# EAGLE design MPS_Drive_Amp_2 (EAGLE 9.5.2)
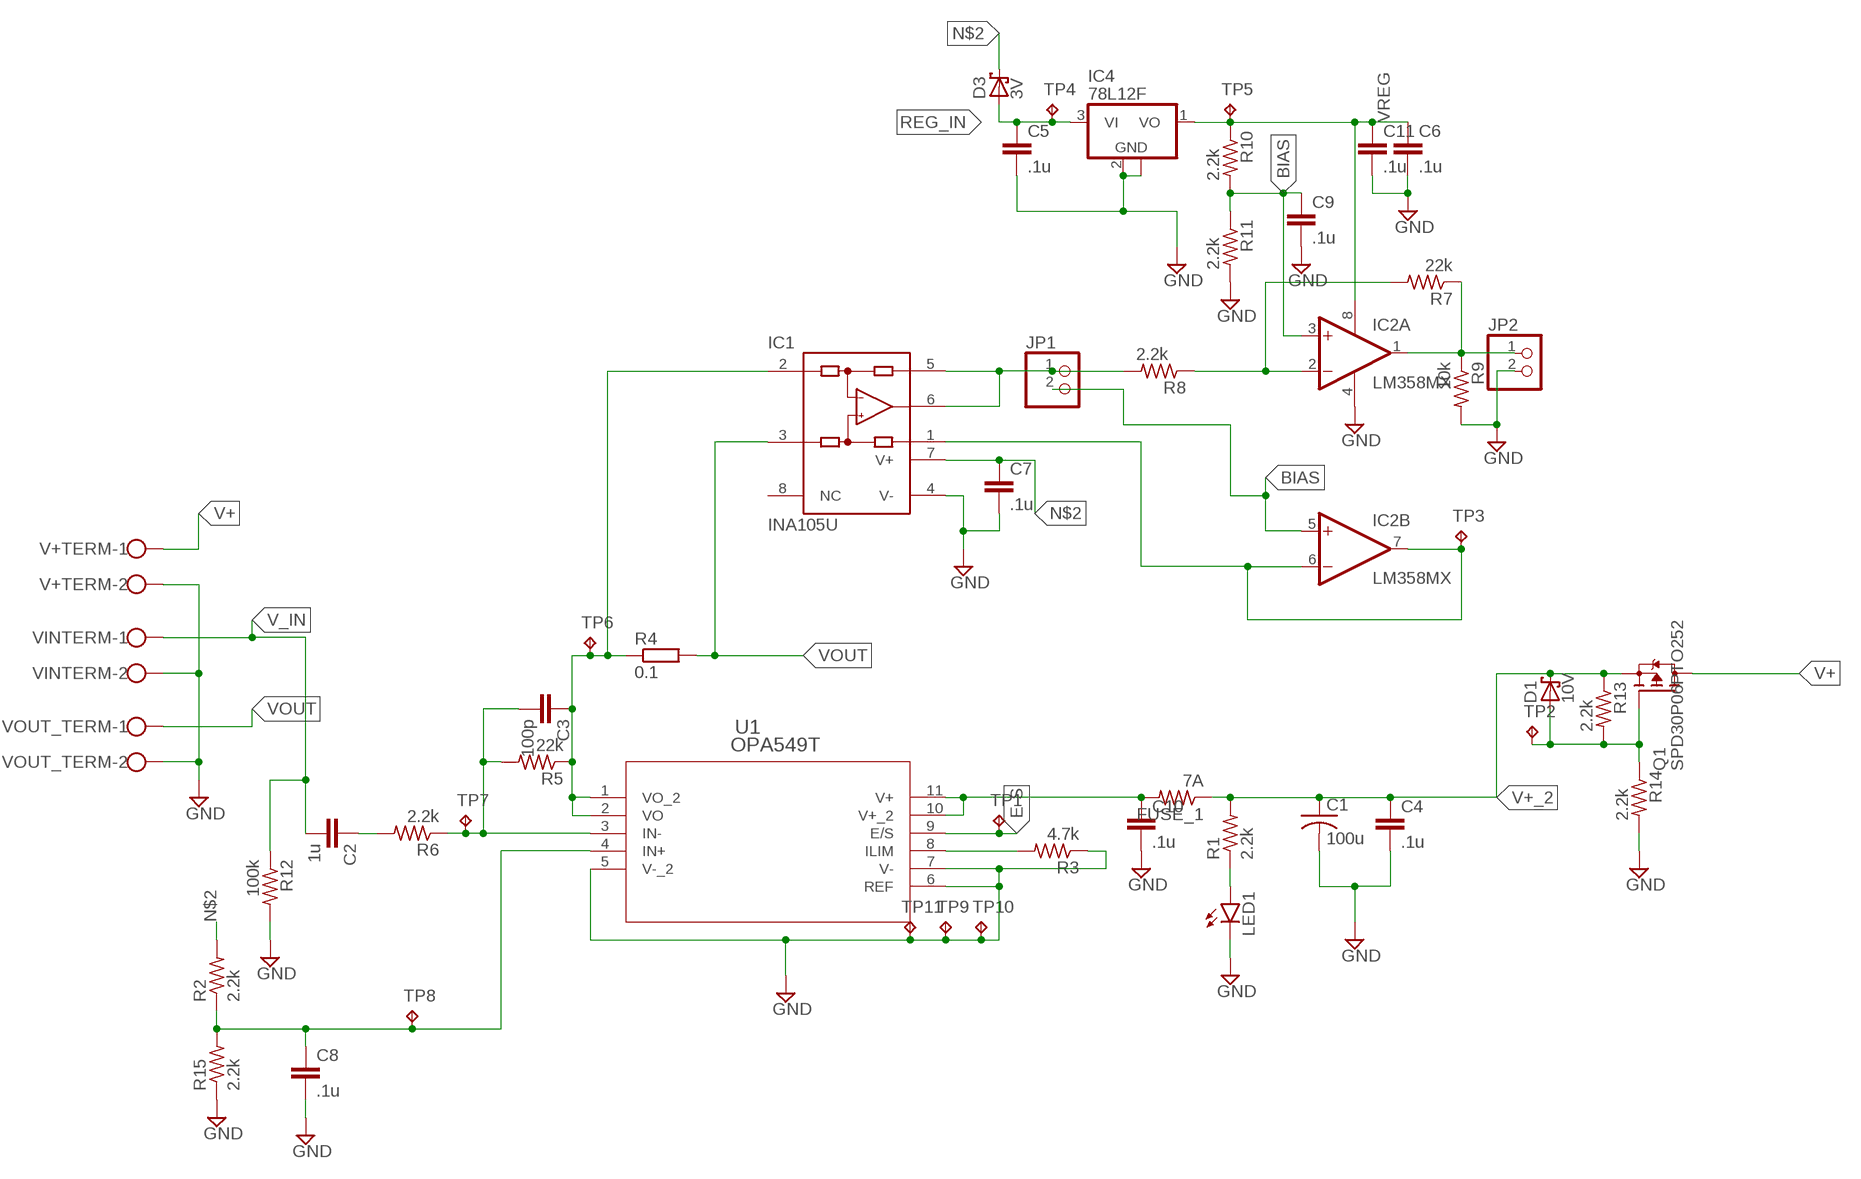
[diagram p0: schematic, sheet 1]

## Parts
C1  100u  C-US050-025X075  [C050-025X075]
C2  1u  C-EUC1206  [C1206]
C3  100p  C-EUC1206  [C1206]
C4  .1u  C-EUC1206  [C1206]
C5  .1u  C-EUC1206  [C1206]
C6  .1u  C-EUC1206  [C1206]
C7  .1u  C-EUC1206  [C1206]
C8  .1u  C-EUC1206  [C1206]
C9  .1u  C-EUC1206  [C1206]
C10  .1u  C-EUC1206  [C1206]
C11  .1u  C-EUC1206  [C1206]
D1  10V  SCHOTTKY-DIODEDO35-7  [DO35-7]
D3  3V  SCHOTTKY-DIODEDO35-7  [DO35-7]
FUSE_1  7A  R-US_R1206  [R1206]
IC1  INA105U  [SO08]
IC2  LM358MX  [SO08]
IC4  78L12F  [SOT89]
JP1  PINHD-1X2  [1X02]
JP2  PINHD-1X2  [1X02]
LED1  LEDCHIPLED_0805  [CHIPLED_0805]
Q1  SPD30P06PTO252  [TO252]
R1  2.2k  R-US_R1206  [R1206]
R2  2.2k  R-US_R1206  [R1206]
R3  4.7k  R-US_R1206  [R1206]
R4  0.1  R-EU_VTA52  [VTA52]
R5  22k  R-US_R1206  [R1206]
R6  2.2k  R-US_R1206  [R1206]
R7  22k  R-US_R1206  [R1206]
R8  2.2k  R-US_R1206  [R1206]
R9  10k  R-US_R1206  [R1206]
R10  2.2k  R-US_R1206  [R1206]
R11  2.2k  R-US_R1206  [R1206]
R12  100k  R-US_R1206  [R1206]
R13  2.2k  R-US_R1206  [R1206]
R14  2.2k  R-US_R1206  [R1206]
R15  2.2k  R-US_R1206  [R1206]
TP1  TPTP20SQ  [TP20SQ]
TP2  TPTP20SQ  [TP20SQ]
TP3  TPTP20SQ  [TP20SQ]
TP4  TPTP20SQ  [TP20SQ]
TP5  TPTP20SQ  [TP20SQ]
TP6  TPTP20SQ  [TP20SQ]
TP7  TPTP20SQ  [TP20SQ]
TP8  TPTP20SQ  [TP20SQ]
TP9  TPTP20SQ  [TP20SQ]
TP10  TPTP20SQ  [TP20SQ]
TP11  TPTP20SQ  [TP20SQ]
U1  OPA549T  [KV11]
V+TERM  W237-102  [W237-102]
VINTERM  W237-102  [W237-102]
VOUT_TERM  W237-102  [W237-102]

## Nets
BIAS: C9.1 IC2.3(A:+IN) IC2.5(B:+IN) JP1.2 R10.2 R11.1
E-S: TP1.TP U1.9(E/S)
GND: C1.2 C4.2 C5.2 C6.2 C7.2 C8.2 C9.2 C10.2 C11.2 IC1.4(V-) IC2.4(P:V-) IC4.2(GND) IC4.2@1(GND) JP2.2 LED1.C R3.1 R9.2 R11.2 R12.2 R14.2 R15.1 TP9.TP TP10.TP TP11.TP U1.5(V-_2) U1.6(REF) U1.7(V-) V+TERM.2 VINTERM.2 VOUT_TERM.2
N$1: C3.1 IC1.2(-IN) R4.1 R5.1 TP6.TP U1.1(VO_2) U1.2(VO)
N$2: C7.1 C10.1 D3.C FUSE_1.2 IC1.7(V+) R2.2 U1.10(V+_2) U1.11(V+)
N$3: R3.2 U1.8(ILIM)
N$4: C2.1 R6.2
N$6: LED1.A R1.1
N$7: C3.2 R5.2 R6.1 TP7.TP U1.3(IN-)
N$8: IC1.5(SENSE) IC1.6(OUT) JP1.1 R8.2
N$9: IC1.1(REF) IC2.6(B:-IN) IC2.7(B:OUT) TP3.TP
N$10: IC2.1(A:OUT) JP2.1 R7.1 R9.1
N$11: C8.1 R2.1 R15.2 TP8.TP U1.4(IN+)
N$12: IC2.2(A:-IN) R7.2 R8.1
PFET_GT: D1.A Q1.1(G) R13.2 R14.1 TP2.TP
REG_IN: C5.1 D3.A IC4.3(VI) TP4.TP
V+: Q1.3(D) V+TERM.1
V+_2: C1.1 C4.1 D1.C FUSE_1.1 Q1.2(S) R1.2 R13.1
V_IN: C2.2 R12.1 VINTERM.1
VOUT: IC1.3(+IN) R4.2 VOUT_TERM.1
VREG: C6.1 C11.1 IC2.8(P:V+) IC4.1(VO) R10.1 TP5.TP
Unconnected: IC1.8(NC)

## Library data of the parts
C1 = rcl:C-US: CAPACITOR, American symbol; SPICEPREFIX: C
C2-C11 = rcl:C-EU: CAPACITOR, European symbol; SPICEPREFIX: C
D1 D3 = adafruit:SCHOTTKY-DIODE: Schottky Diode
FUSE_1 R1-R3 R5-R15 = rcl:R-US_: RESISTOR, American symbol; SPICEPREFIX: R
IC1 = burr-brown:INA105: Precision Unity Gain Diff. Amplifier; MF: TEXAS INSTRUMENTS; MPN: INA105KU; OC_FARNELL: 1754832; OC_NEWARK: 35C0475
IC2 = linear:LM358: OP AMP also LM158; LM258; LM2904 Source: http://cache.national.com/ds/LM/LM158.pdf
IC4 = linear:78L*: POSITOIV-VOLTAGE REGULATORS Output up to 100 mA Source: Datasheet <http://focus.ti.com/lit/ds/symlink/ua78l05.pdf>
JP1 JP2 = pinhead:PINHD-1X2: PIN HEADER
LED1 = Favorite_Parts:LED: LED OSRAM: - CHIPLED LG R971, LG N971, LY N971, LG Q971, LY Q971, LO R971, LY R971 LH N974, LH R974 LS Q976, LO Q976, LY Q976 LO Q996 - Hyper CHIPLED LW Q18S LB Q993, LB Q99A, LB R99A - SideLED LS A670, LO A670, LY A670, LG A670, LP A670 LB A673, LV A673, LT A673, LW A673 LH A674 LY A675 LS A676, LA A676, LO A676, LY A676, LW A676 LS A679, LY A679, LG A679 - Hyper Micro SIDELED® LS Y876, LA Y876, LO Y876, LY Y876 LT Y87S - SmartLED LW L88C, LW L88S LB L89C, LB L89S, LG L890 LS L89K, LO L89K, LY L89K LS L896, LA L896, LO L896, LY L896 - TOPLED LS T670, LO T670, LY T670, LG T670, LP T670 LSG T670, LSP T670, LSY T670, LOP T670, LYG T670 LG T671, LOG T671, LSG T671 LB T673, LV T673, LT T673, LW T673 LH T674 LS T676, LA T676, LO T676, LY T676, LB T676, LH T676, LSB T676, LW T676 LB T67C, LV T67C, LT T67C, LS T67K, LO T67K, LY T67K, LW E67C LS E67B, LA E67B, LO E67B, LY E67B, LB E67C, LV E67C, LT E67C LW T67C LS T679, LY T679, LG T679 LS T770, LO T770, LY T770, LG T770, LP T770 LB T773, LV T773, LT T773, LW T773 LH T774 LS E675, LA E675, LY E675, LS T675 LS T776, LA T776, LO T776, LY T776, LB T776 LHGB T686 LT T68C, LB T68C - Hyper Mini TOPLED® LB M676 - Mini TOPLED Santana® LG M470 LS M47K, LO M47K, LY M47K Source: http://www.osram.convergy.de LUXEON: - LUMILED® LXK2-PW12-R00, LXK2-PW12-S00, LXK2-PW14-U00, LXK2-PW14-V00 LXK2-PM12-R00, LXK2-PM12-S00, LXK2-PM14-U00 LXK2-PE12-Q00, LXK2-PE12-R00, LXK2-PE12-S00, LXK2-PE14-T00, LXK2-PE14-U00 LXK2-PB12-K00, LXK2-PB12-L00, LXK2-PB12-M00, LXK2-PB14-N00, LXK2-PB14-P00, LXK2-PB14-Q00 LXK2-PR12-L00, LXK2-PR12-M00, LXK2-PR14-Q00, LXK2-PR14-R00 LXK2-PD12-Q00, LXK2-PD12-R00, LXK2-PD12-S00 LXK2-PH12-R00, LXK2-PH12-S00 LXK2-PL12-P00, LXK2-PL12-Q00, LXK2-PL12-R00 Source: www.luxeon.com KINGBRIGHT: KA-3528ASYC Source: www.kingbright.com
Q1 = transistor-fet:SPD30P06P: SIPMOS(R) Power-Transistor P-Channel, Enhancement mode Source: http://www.infineon.com/upload/Document/cmc_upload/documents/012/3615/SPD_U30P06P.pdf
R4 = rcl:R-EU_: RESISTOR, European symbol; SPICEPREFIX: R
TP1-TP11 = Favorite_Parts:TP: Test pad
U1 = MyParts:OPA549T; DATASHEET_URL: http://www.ti.com/lit/gpn/OPA549; DESCRIPTION: High-Voltage, High-Current Op Amp, Excellent Output Swing; FAMILY_NAME: HIGH OUTPUT CURRENT; GENERIC_PART_NUMBER: OPA549; INDUSTRY_STD_PKG_TYPE: TO-220; MANUFACTURER: Texas Instruments; MANUFACTURER_PART_NUMBER: OPA549T; PACKAGE_DESIGNATOR: KV; PIN_COUNT: 11; VENDOR: Texas Instruments
V+TERM VINTERM VOUT_TERM = con-wago-500:W237-102: WAGO SCREW CLAMP; MPN: 237-102; OC_FARNELL: unknown; OC_NEWARK: 70K9898

## Board
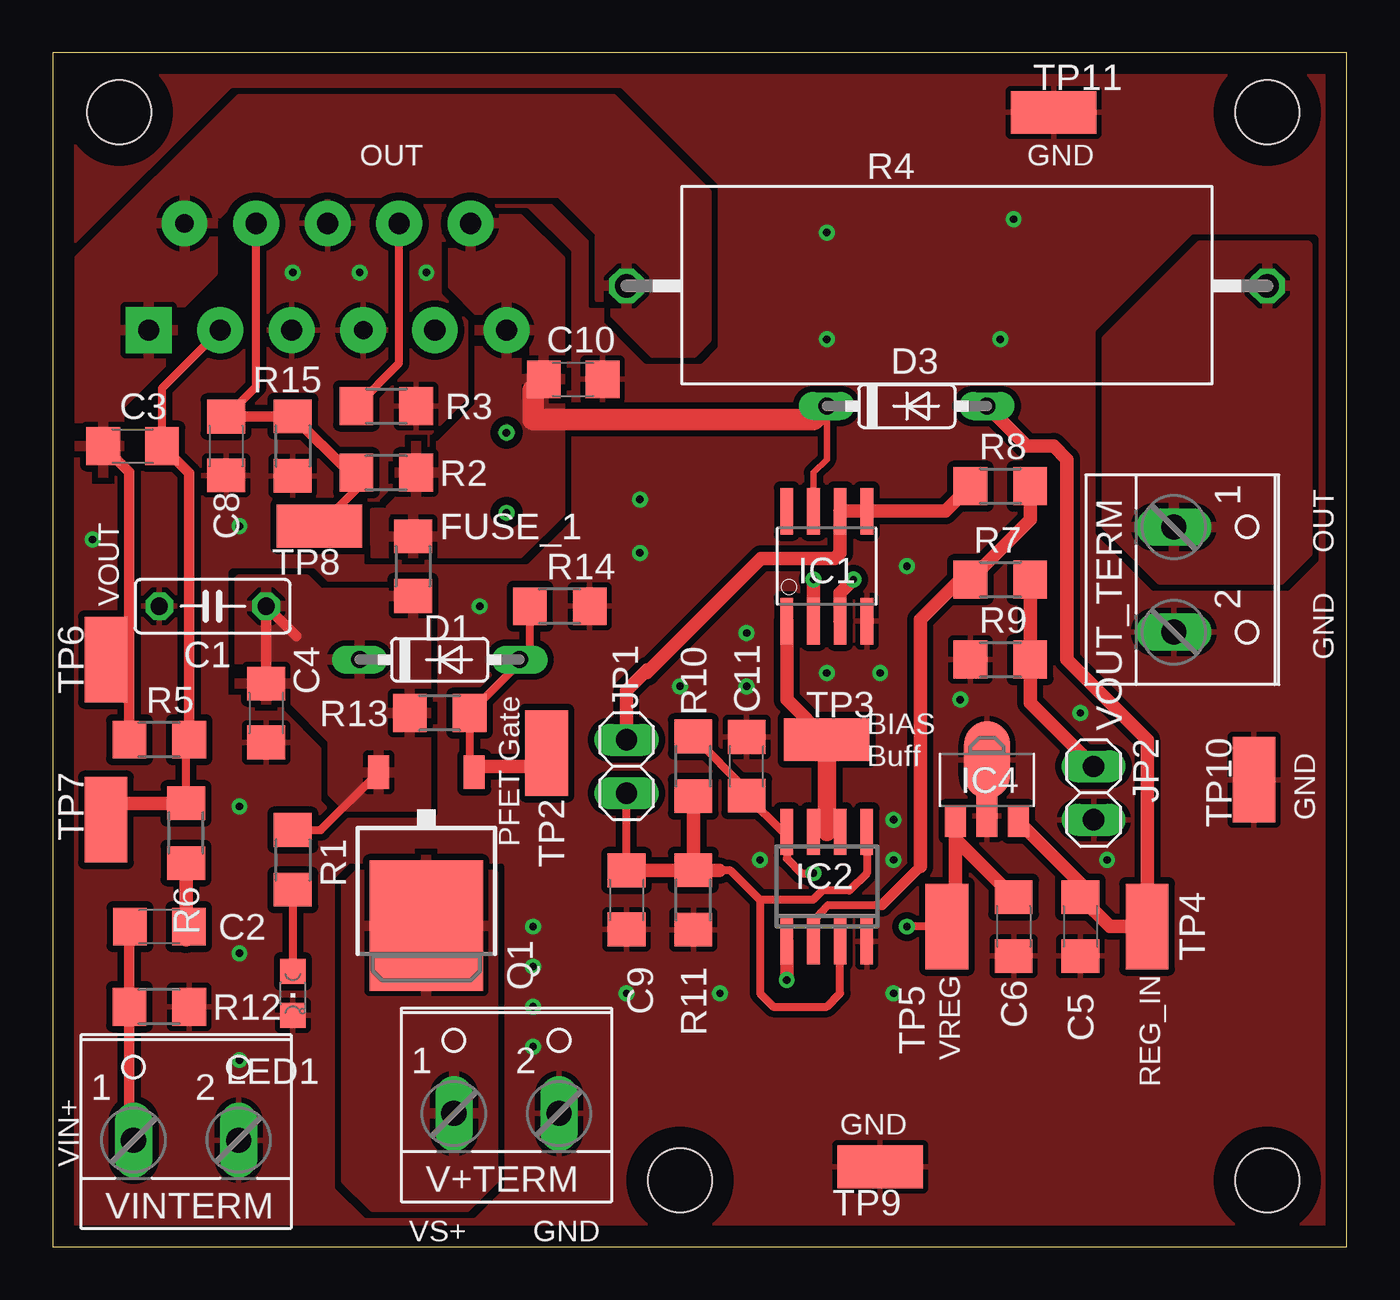
[diagram p1: board, top side]
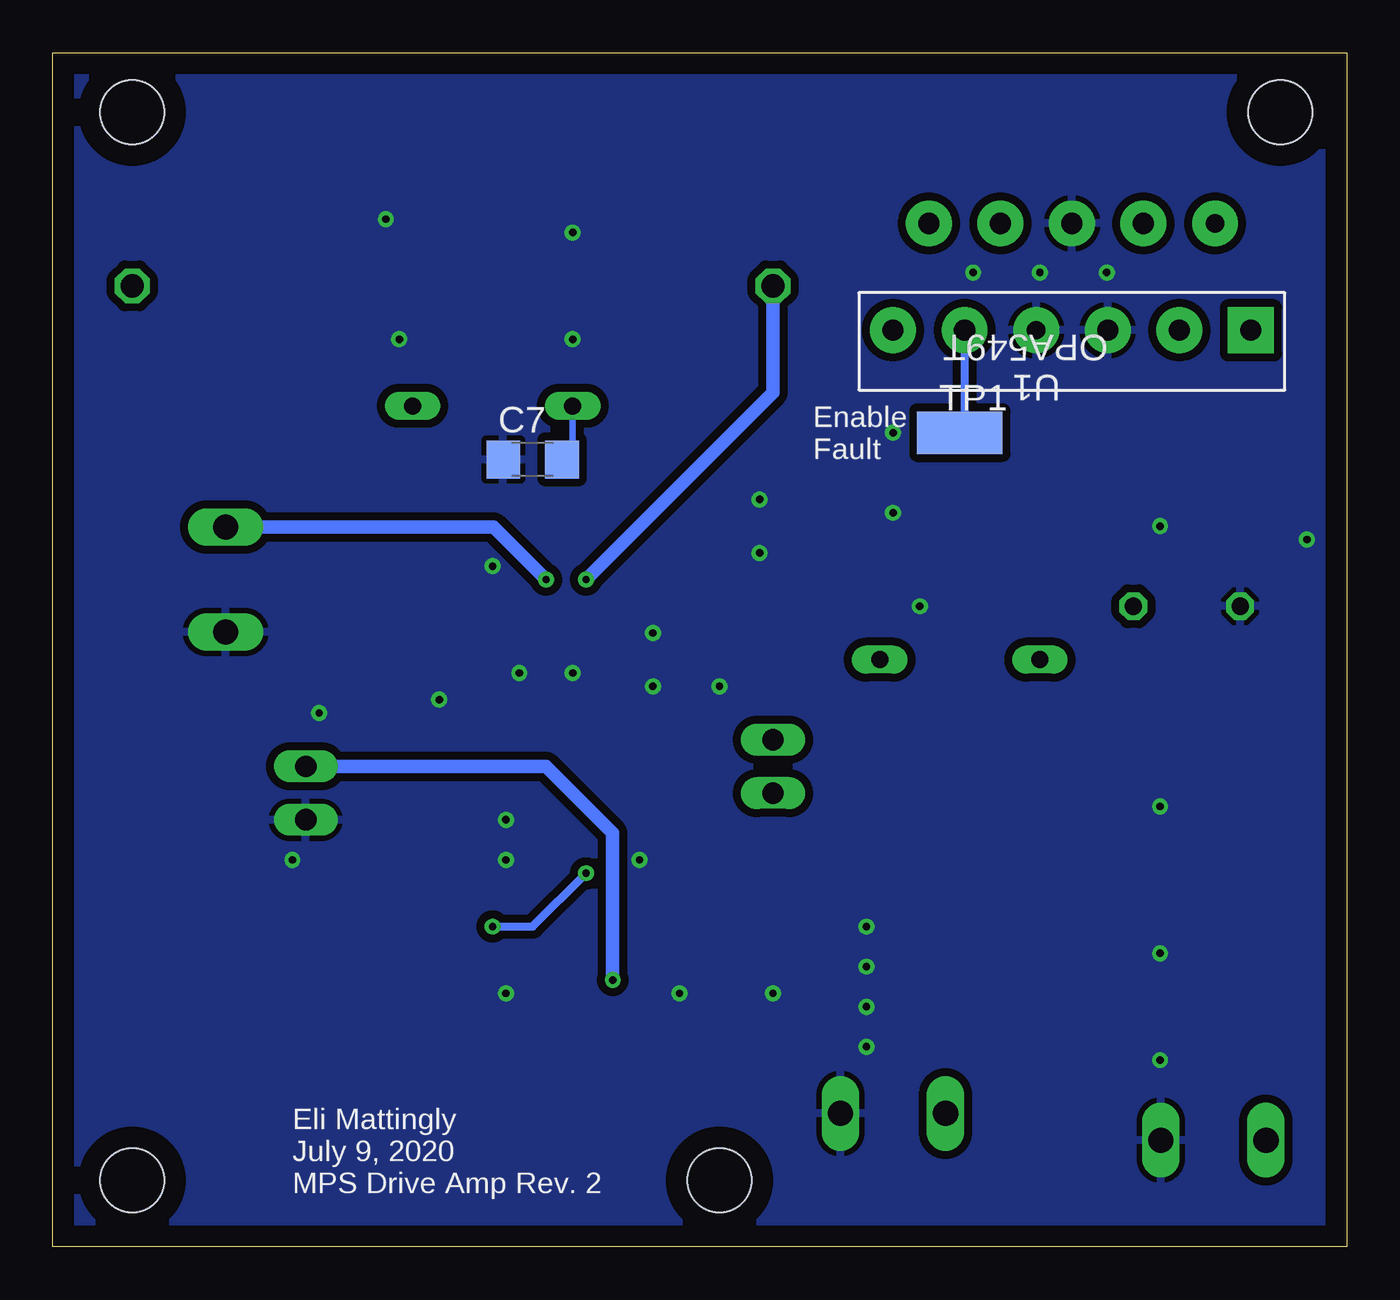
[diagram p2: board, bottom side, seen from below]

Size 61.58 x 56.82 mm. Coordinates in mm from the lower left corner, seen from the top.
Outline: 0,0 61.58,0 61.58,56.82 0,56.82 0,0
Copper layers (1*16): Top 0.035mm / dielectric 1.5mm / Bottom 0.035mm
Design rules "default *": minimum track width 6mil, minimum drill 0.35mm, track to track 12mil, track to pad 12mil, pad to pad 12mil, via to via 12mil, smd to smd 6mil, copper to edge 40mil, drill to drill 6mil, minimum pad ring 10mil, minimum via ring 8mil, stop-mask expansion 4mil, vias tented up to drill 0mil, thermal gap 10mil
Holes 3.05 mm at 57.78,3.17 3.17,53.98 57.78,53.98 29.84,3.17

### Footprints (pad centres in the part's own frame; a part is rotated, then mirrored left to right if it is on the bottom)
C050-025X075 = drill 0.813 octagon: 1 -2.54,0; 2 2.54,0
C1206 = smd 1.6 x 1.8: 1 -1.4,0; 2 1.4,0
DO35-7 = drill 0.813 long: A 3.81,0; C -3.81,0
R1206 = smd 1.6 x 1.803: 1 -1.422,0; 2 1.422,0
SO08 = smd 0.61 x 2.21: 1 -1.905,-2.616; 2 -0.635,-2.616; 3 0.635,-2.616; 4 1.905,-2.616; 5 1.905,2.616; 6 0.635,2.616; 7 -0.635,2.616; 8 -1.905,2.616
SO08' = smd 0.6 x 2.2: 1 -1.905,-2.6; 2 -0.635,-2.6; 3 0.635,-2.6; 4 1.905,-2.6; 5 1.905,2.6; 6 0.635,2.6; 7 -0.635,2.6; 8 -1.905,2.6
SOT89 = smd 1 x 1.5: 1 -1.499,-1.981; 3 1.499,-1.981 | smd 1 x 2: 2 0,-1.727 | smd 2.2 x 3.7: 2@1 0,0.94
1X02 = drill 1.016 long: 1 -1.27,0; 2 1.27,0
CHIPLED_0805 = smd 1.2 x 1.2: A 0,-1.05; C 0,1.05
TO252 = smd 1 x 1.6: 1 -2.28,-4.8; 2 2.28,-4.8 | smd 5.4 x 6.2: 3 0,2.5
VTA52 = drill 1.1 octagon: 1 -15.24,0; 2 15.24,0
TP20SQ = smd 4.064 x 2.032: TP 0,0
KV11 = drill 1 pad 2.184 square: 1 -17.018,-1.067 | drill 0.864 pad 2.184: 2 -15.316,-6.147; 7 -6.807,-1.067 | drill 1 pad 2.184: 3 -13.614,-1.067; 4 -11.913,-6.147; 5 -10.211,-1.067; 6 -8.509,-6.147; 8 -5.105,-6.147; 9 -3.404,-1.067; 10 -1.702,-6.147; 11 0,-1.067
W237-102 = drill 1.194 long: 1 -2.5,-1.27; 2 2.5,-1.27

### Placement (x,y rotation side)
C1  7.62,30.48 180 top
C2  5.08,15.24 180 top
C3  3.81,38.1 0 top
C4  10.16,25.4 270 top
C5  48.9,15.24 270 top
C6  45.72,15.24 270 top
C7  38.73,37.47 180 bottom
C8  8.26,38.1 270 top
C9  27.3,16.51 270 top
C10  24.77,41.27 0 top
C11  33.02,22.86 90 top
D1  18.41,27.94 0 top
D3  40.64,40.01 0 top
FUSE_1  17.14,32.38 90 top
IC1  36.83,32.38 0 top
IC2  LM358MX  [SO08']  36.83,17.14 0 top
IC4  44.45,22.23 0 top
JP1  27.3,22.86 270 top
JP2  49.53,21.59 270 top
LED1  11.43,12.06 180 top
Q1  17.78,17.78 180 top
R1  11.43,18.41 90 top
R2  15.88,36.83 0 top
R3  15.88,40.01 180 top
R4  42.55,45.72 0 top
R5  5.08,24.13 0 top
R6  6.35,19.68 270 top
R7  45.09,31.75 180 top
R8  45.09,36.2 180 top
R9  45.09,27.94 180 top
R10  30.48,22.86 270 top
R11  30.48,16.51 270 top
R12  5.08,11.43 0 top
R13  18.41,25.4 0 top
R14  24.13,30.48 0 top
R15  11.43,38.1 90 top
TP1  18.41,38.73 0 bottom
TP2  23.5,23.5 90 top
TP3  36.83,24.13 0 top
TP4  52.07,15.24 90 top
TP5  42.55,15.24 90 top
TP6  2.54,27.94 90 top
TP7  2.54,20.32 90 top
TP8  12.7,34.29 180 top
TP9  39.37,3.81 180 top
TP10  57.15,22.23 90 top
TP11  47.62,53.98 0 top
U1  21.59,42.55 180 bottom
V+TERM  21.59,7.62 0 top
VINTERM  6.35,6.35 0 top
VOUT_TERM  54.61,31.75 270 top

### Tracks (layer width: path | path; a pad name or v marks a point on that pad's centre or on a via)
BIAS
  Top 0.381: 33.66,16.51 32.26,17.91 31.73,17.91 | 33.66,16.51 33.66,12.06 34.29,11.43 36.83,11.43 37.47,12.06 IC2.3 | IC2.5 38.73,17.78 37.91,16.95 36.62,16.95 36.18,16.51 33.66,16.51 | C9.1 JP1.2
  Top 0.635: R10.2 R11.1 30.46,17.91 | 31.73,17.91 30.46,17.91 | 30.46,17.91 C9.1
E-S
  Bottom 0.381: U1.9 18.19,38.96 TP1.TP
GND  (via drill 0.35)
  other vias: 36.83,27.3 39.37,27.3 40.64,32.38 20.32,30.48 27.94,33.02 27.94,35.56 21.59,34.92 21.59,38.73 36.83,43.18 45.09,43.18 36.83,48.26 45.72,48.9 40.01,20.32 40.01,18.41 40.01,12.06 31.75,12.06 27.3,12.06 8.89,8.89 8.89,13.97 8.89,20.95 8.89,34.29 1.91,33.66 11.43,46.35 14.61,46.35 43.18,26.04 50.16,18.41 48.9,25.4 33.66,18.41 17.78,46.35 33.02,26.67 29.84,26.67 33.02,29.21 22.86,9.53 22.86,11.43 22.86,13.34 22.86,15.24
  pour Top (rank 2): -2.54,-2.54 -2.54,58.42 61.59,58.42 61.59,-2.54
  pour Bottom (isolate 0.381): -0.64,57.15 -0.64,0 61.46,0 61.46,57.15
N$1  (via drill 0.35)
  Top 0.381: TP6.TP 3.66,26.82 R5.1
  Top 0.508: C3.1 3.66,36.85 R5.1
  Top 0.635: IC1.2 v36.2,31.75
  Bottom 0.635: v36.2,31.75 27.3,40.64 R4.1
  pour Top (isolate 0.381): 3.17,36.83 1.27,36.83 1.27,46.99 8.89,54.61 26.67,54.61 31.11,50.16 31.11,43.18 30.48,42.55 28.57,42.55 26.04,45.09 26.04,48.26 24.13,50.16 8.89,50.16 7.62,48.9 7.62,46.35 5.71,44.45 5.71,42.55 3.17,40.01
N$2
  Top 0.305: D3.C 36.83,37.47 36.2,36.83 IC1.7
  Top 1.016: D3.C 36.2,39.37 22.86,39.37 22.86,40.77 C10.1
  Bottom 0.305: C7.1 36.83,37.97 D3.C
  pour Top (isolate 0.381): 15.24,34.92 15.24,33.02 22.23,33.02 24.13,34.92 24.13,46.99 22.23,48.9 19.05,48.9 19.05,45.72 20.32,44.45 20.32,40.01 18.41,38.1 17.14,38.1 16.51,37.47 16.51,35.56 15.88,34.92
N$3
  Top 0.381: R3.2 16.48,42.04 U1.8
N$4
  Top 0.635: R6.2 6.35,14.61 6.48,14.73 C2.1
N$6
  Top 0.381: R1.1 LED1.A
N$7
  Top 0.381: TP7.TP 3.33,21.11 | R6.1 6.35,23.98 R5.2 | C3.2 5.21,40.85 U1.3
  Top 0.508: R5.2 6.5,36.81 C3.2
  Top 0.635: 3.33,21.11 R6.1
N$8
  Top 0.635: R8.2 42.47,35 IC1.5 IC1.6 37.47,33.02 37.2,32.75 33.71,32.75 28.28,27.32 28.28,27.45 27.3,26.48 JP1.1
N$9
  Top 0.381: IC2.7 36.83,19.75 IC2.6
  Top 0.635: TP3.TP 34.92,26.04 IC1.1
  Top 0.889: 36.83,19.75 TP3.TP
N$10  (via drill 0.35)
  Top 0.635: R7.1 R9.1 46.51,25.88 JP2.1 | IC2.1 v34.92,12.7
  Bottom 0.635: v34.92,12.7 34.92,19.68 38.1,22.86 JP2.1
N$11
  Top 0.381: TP8.TP 14.45,36.04 R2.1 | C8.1 9.68,40.92 U1.4
  Top 0.508: C8.1 11.41,39.5 R15.2 14.12,36.83 R2.1
N$12
  Top 0.381: 39.44,16.27 36.91,16.27 36.54,15.9 36.2,15.55 IC2.2
  Top 0.508: 39.44,16.27 41.27,18.1
  Top 0.635: R8.1 46.51,34.59 R7.2 43.18,31.75 41.27,29.84 41.27,18.1
PFET_GT
  Top 0.381: Q1.1 19.84,22.8 R13.2 22.23,27.79 D1.A 22.71,28.42 R14.1
  Top 0.635: Q1.1 20.34,22.86 23.5,22.86 TP2.TP
REG_IN
  Top 0.635: IC4.3 48.9,17.3 C5.1 50.3,15.24 TP4.TP 52.07,24.13 48.26,27.94 48.26,37.47 47.62,38.1 46.35,38.1 D3.A
V+
  pour Top (isolate 0.381): 15.24,18.41 13.97,17.14 13.97,3.17 15.24,1.91 19.68,1.91 20.95,3.17 20.95,17.14 20.95,17.78 20.32,18.41
V+_2
  Top 0.381: R1.2 12.76,19.84 Q1.2
  Top 0.508: C4.1 C1.1 11.58,29.06
  pour Top (isolate 0.508): 8.89,31.75 8.89,26.04 11.43,26.04 13.34,24.13 13.34,21.59 13.97,20.95 17.78,20.95 17.78,31.11 12.7,31.11 12.06,31.75
V_IN
  Top 0.508: VINTERM.1 3.66,5.27 R12.1 3.66,15.22 C2.2
VOUT  (via drill 0.35)
  Top 0.635: IC1.3 37.47,31.11 v38.1,31.75
  Bottom 0.635: v38.1,31.75 40.6,34.25 VOUT_TERM.1
  pour Top (isolate 0.381): 54.61,47.62 59.69,47.62 59.69,33.02 58.42,31.75 52.7,31.75 50.16,34.29 50.16,43.18
VREG  (via drill 0.35)
  Top 0.381: TP5.TP v40.64,15.24 | IC2.8 34.92,18.48 35.62,17.78 v36.2,17.78 | IC2.8 34.92,19.84 | R10.1 33.02,21.74 C11.1 34.73,19.75 IC2.8
  Top 0.635: C6.1 42.95,19.41 IC4.1 42.95,15.65 TP5.TP
  Bottom 0.381: v40.64,15.24 38.73,15.24 v36.2,17.78

### Text on the board
tNames: OUT | GND | OUT | VOUT | GND | BIAS / Buff | GND | PFET Gate | VREG | REG_IN | GND | VIN+ | VS+ | GND
bNames: Enable / Fault | Eli Mattingly / July 9, 2020 / MPS Drive Amp Rev. 2